# EAGLE design Computer Power Relay - Merge (EAGLE 9.6.2)
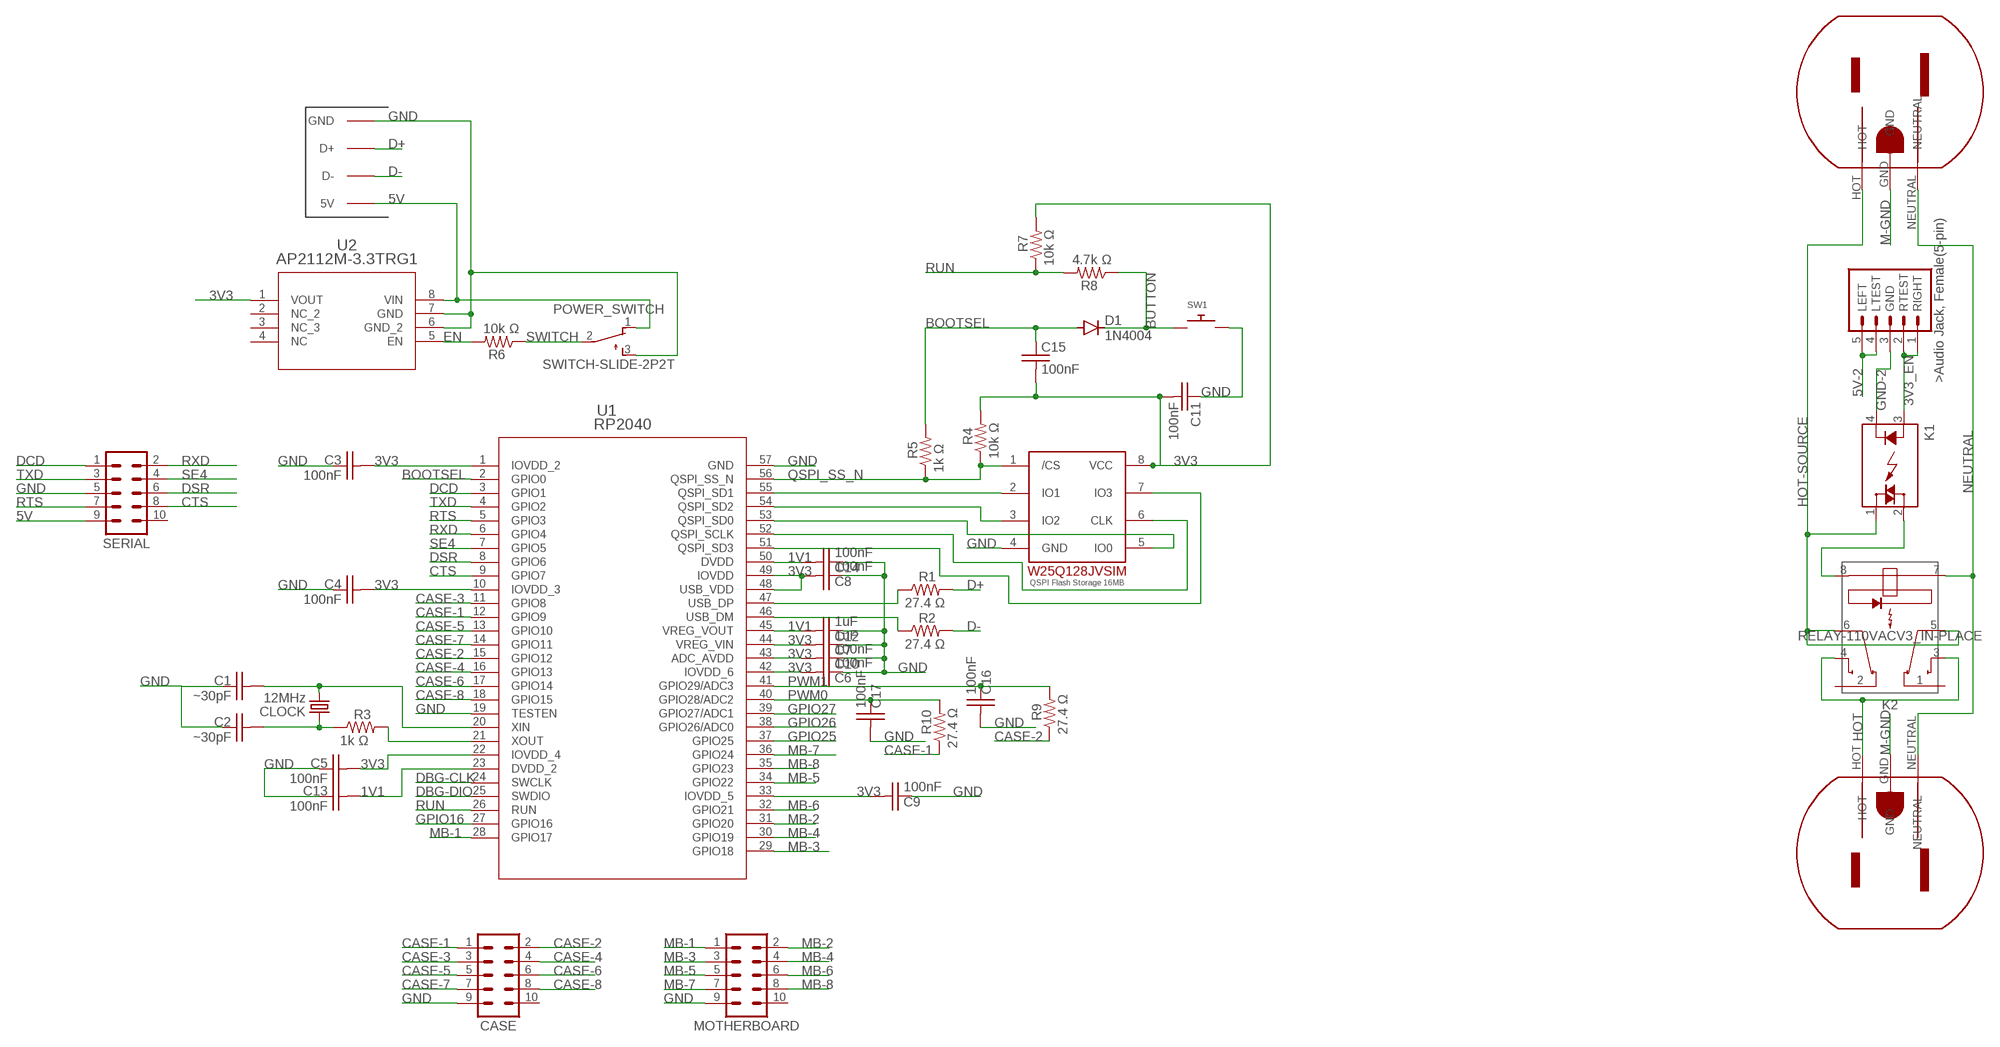
[diagram p0: schematic, sheet 1]

## Parts
C1  ~30pF  CAP-NONPOL-USC0402K  [C0402K]
C2  ~30pF  CAP-NONPOL-USC0402K  [C0402K]
C3  100nF  CAP-NONPOL-USC0402K  [C0402K]
C4  100nF  CAP-NONPOL-USC0402K  [C0402K]
C5  100nF  CAP-NONPOL-USC0402K  [C0402K]
C6  100nF  CAP-NONPOL-USC0402K  [C0402K]
C7  1uF  CAP-NONPOL-USC0402K  [C0402K]
C8  100nF  CAP-NONPOL-USC0402K  [C0402K]
C9  100nF  CAP-NONPOL-USC0402K  [C0402K]
C10  100nF  CAP-NONPOL-USC0402K  [C0402K]
C11  100nF  CAP-NONPOL-USC0402K  [C0402K]
C12  1uF  CAP-NONPOL-USC0402K  [C0402K]
C13  100nF  CAP-NONPOL-USC0402K  [C0402K]
C14  100nF  CAP-NONPOL-USC0402K  [C0402K]
C15  100nF  CAP-NONPOL-USC0402K  [C0402K]
C16  100nF  CAP-NONPOL-USC0402K  [C0402K]
C17  100nF  CAP-NONPOL-USC0402K  [C0402K]
CASE  MA05-2  [MA05-2]
CLOCK  12MHz  CRYSTALHC49S  [HC49/S]
D1  1N4004  [DO41-10]
K1  RELAY-3V3DC-110VAC012  [RELAY-3V3-110V]
K2  RELAY-110VACV3_IN-PLACE  [RELAY-110VAC-V3]
MOTHERBOARD  MA05-2  [MA05-2]
POWER_SWITCH  SWITCH-SLIDE-2P2T  [SWITCH-SLIDE-2P2T]
R1  27.4 Ω  R-US_R0603  [R0603]
R2  27.4 Ω  R-US_R0603  [R0603]
R3  1k Ω  R-US_R0603  [R0603]
R4  10k Ω  R-US_R0603  [R0603]
R5  1k Ω  R-US_R0603  [R0603]
R6  10k Ω  R-US_R0603  [R0603]
R7  10k Ω  R-US_R0603  [R0603]
R8  4.7k Ω  R-US_R0603  [R0603]
R9  27.4 Ω  R-US_R0603  [R0603]
R10  27.4 Ω  R-US_R0603  [R0603]
SERIAL  MA05-2  [MA05-2]
SW1  SWITCH_PUSHBUTTONSOFTTOUCHSMD_SJ  [PUSHBUTTON_TH]
U1  RP2040  [IC57_RP2040]
U2  AP2112M-3.3TRG1  [AP2112M-3.3TRG1_DIO]
U$1  W25Q128JVSIM-ND__QSPI-FLASH  [SO08]
U$2  PCB_USB  [PCB_USB]
U$3  MAINS-POWER-OUTLET3-PIN  [3-PIN-POWER]
U$4  MAINS-POWER-OUTLET3-PIN  [3-PIN-POWER]
U$5  AUDIO_JACK_FEMALE_5-PIN  [AUDIO_JACK_FEMALE_5-PIN]

## Nets
1V1: C12.2 C13.2 C14.2 U1.23(DVDD_2) U1.45(VREG_VOUT) U1.50(DVDD)
3V3: C3.2 C4.2 C5.2 C6.2 C7.2 C8.2 C9.2 C10.2 C11.2 C15.2 R4.2 R7.2 U1.1(IOVDD_2) U1.10(IOVDD_3) U1.22(IOVDD_4) U1.33(IOVDD_5) U1.42(IOVDD_6) U1.43(ADC_AVDD) U1.44(VREG_VIN) U1.48(USB_VDD) U1.49(IOVDD) U2.1(VOUT) U$1.8(VCC)
3V3_EN: K1.3 U$5.1(RIGHT) U$5.2(RTEST)
5V: POWER_SWITCH.1(O) SERIAL.9 U2.8(VIN) U$2.5V U$2.5V_2(5V)
5V-2: U$5.4(LTEST) U$5.5(LEFT)
BOOTSEL: C15.1 D1.A R5.2 U1.2(GPIO0)
BUTTON: D1.C R8.1 SW1.P$1
CASE-1: CASE.1 R10.1 U1.12(GPIO9)
CASE-2: CASE.2 R9.1 U1.15(GPIO12)
CASE-3: CASE.3 U1.11(GPIO8)
CASE-4: CASE.4 U1.16(GPIO13)
CASE-5: CASE.5 U1.13(GPIO10)
CASE-6: CASE.6 U1.17(GPIO14)
CASE-7: CASE.7 U1.14(GPIO11)
CASE-8: CASE.8 U1.18(GPIO15)
CTS: SERIAL.8 U1.9(GPIO7)
D+: R1.2 U$2.D+ U$2.D+_2(D+)
D-: R2.2 U$2.D- U$2.D-_2(D-)
DBG-CLK: U1.24(SWCLK)
DBG-DIO: U1.25(SWDIO)
DCD: SERIAL.1 U1.3(GPIO1)
DSR: SERIAL.6 U1.8(GPIO6)
EN: R6.2 U2.5(EN)
GND: C1.1 C2.1 C3.1 C4.1 C5.1 C6.1 C7.1 C8.1 C9.1 C10.1 C11.1 C12.1 C13.1 C14.1 C16.2 C17.2 CASE.9 MOTHERBOARD.9 POWER_SWITCH.3(S) SERIAL.5 SW1.P$2 U1.19(TESTEN) U1.57(GND) U2.6(GND_2) U2.7(GND) U$1.4(GND) U$2.GND U$2.GND_2(GND)
GND-2: K1.4 U$5.3(GND)
GPIO16: U1.27(GPIO16)
GPIO25: U1.37(GPIO25)
GPIO26: U1.38(GPIO26/ADC0)
GPIO27: U1.39(GPIO27/ADC1)
HOT: K2.3 K2.4 U$4.HOT
HOT-SOURCE: K1.1 K2.5 K2.6 U$3.HOT
M-GND: U$3.GND U$4.GND
MB-1: MOTHERBOARD.1 U1.28(GPIO17)
MB-2: MOTHERBOARD.2 U1.31(GPIO20)
MB-3: MOTHERBOARD.3 U1.29(GPIO18)
MB-4: MOTHERBOARD.4 U1.30(GPIO19)
MB-5: MOTHERBOARD.5 U1.34(GPIO22)
MB-6: MOTHERBOARD.6 U1.32(GPIO21)
MB-7: MOTHERBOARD.7 U1.36(GPIO24)
MB-8: MOTHERBOARD.8 U1.35(GPIO23)
N$1: R1.1 U1.47(USB_DP)
N$2: R2.1 U1.46(USB_DM)
N$3: C2.2 CLOCK.2 R3.1
N$4: R3.2 U1.21(XOUT)
N$5: C1.2 CLOCK.1 U1.20(XIN)
N$9: K1.2 K2.8
N$16: U1.54(QSPI_SD2) U$1.3(IO2)
N$17: U1.55(QSPI_SD1) U$1.2(IO1)
N$18: U1.53(QSPI_SD0) U$1.5(IO0)
N$19: U1.52(QSPI_SCLK) U$1.6(CLK)
N$20: U1.51(QSPI_SD3) U$1.7(IO3)
NEUTRAL: K2.7 U$3.NEUTRAL U$4.NEUTRAL
PWM0: C17.1 R10.2 U1.40(GPIO28/ADC2)
PWM1: C16.1 R9.2 U1.41(GPIO29/ADC3)
QSPI_SS_N: R4.1 R5.1 U1.56(QSPI_SS_N) U$1.1(/CS)
RTS: SERIAL.7 U1.5(GPIO3)
RUN: R7.1 R8.2 U1.26(RUN)
RXD: SERIAL.2 U1.6(GPIO4)
SE4: SERIAL.4 U1.7(GPIO5)
SWITCH: POWER_SWITCH.2(P) R6.1
TXD: SERIAL.3 U1.4(GPIO2)
Unconnected: CASE.10 K2.1 K2.2 MOTHERBOARD.10 SERIAL.10 U2.2(NC_2) U2.3(NC_3) U2.4(NC)

## Library data of the parts
C1-C17 = adafruit:CAP-NONPOL-US: CAPACITOR, American symbol
CASE MOTHERBOARD SERIAL = con-lstb:MA05-2: PIN HEADER; OC_FARNELL: unknown; OC_NEWARK: unknown
CLOCK = crystal:CRYSTAL: CRYSTAL; OC_FARNELL: 1667008; OC_NEWARK: unknown
D1 = KVM Keyboard:1N4004: DIODE general purpose rectifier, 1 A
K1 = Inventory:RELAY-3V3DC-110VAC: AUTOMOTIVE LOW PROFILE MICRO-280 RELAY NAiS Source: http://www.mew-europe.com/.. en_ds_61214_0000.pdf; MPN: ACV33012; OC_FARNELL: unknown; OC_NEWARK: 39M3505
K2 = Inventory:RELAY-110VAC: SOLID STATE RELAY NAiS Source: http://www.mew-europe.com/.. en_ds_61606_0000.pdf
POWER_SWITCH = Inventory:SWITCH-SLIDE-2P2T: TINY SWITCH ON - MOM Source: http://www2.produktinfo.conrad.com/datenblaetter/700000-724999/705152-da-01-de-Subminiaturschalter_TL_36YO.pdf
R1-R10 = rcl:R-US_: RESISTOR, American symbol; SPICEPREFIX: R
SW1 = KVM Keyboard:SWITCH_PUSHBUTTON: Buttons SOFTTOUCHSMD_SJ - Soft touch temporary push button (Super Junk Akihabara) Compatible with SKPMANE010 [Mouser: 688-SKPMAN] C&K_KSS = Digikey: KSS221GLFS
U1 = KVM Keyboard:RP2040; COPYRIGHT: Copyright (C) 2022 Ultra Librarian. All rights reserved.; DIGI-KEY_PART_NUMBER_1: 2648-SC0908(7)TR-ND; DIGI-KEY_PART_NUMBER_2: 2648-SC0908(7)CT-ND; DIGI-KEY_PART_NUMBER_3: 2648-SC0908(7)DKR-ND; MANUFACTURER_PART_NUMBER: SC0908(7); MFR_NAME: Raspberry Pi
U2 = KVM Keyboard:AP2112M-3.3TRG1; COPYRIGHT: Copyright (C) 2022 Ultra Librarian. All rights reserved.; DIGI-KEY_PART_NUMBER_1: AP2112M-3.3TRG1DITR-ND; DIGI-KEY_PART_NUMBER_2: AP2112M-3.3TRG1DICT-ND; DIGI-KEY_PART_NUMBER_3: AP2112M-3.3TRG1DIDKR-ND; MANUFACTURER_PART_NUMBER: AP2112M-3.3TRG1; MFR_NAME: Diodes Inc
U$1 = KVM Keyboard:W25Q128JVSIM-ND__QSPI-FLASH: National LM3622 li-ion charger http://www.ladyada.net/library/eagle
U$2 = KVM Keyboard:PCB_USB
U$3 U$4 = Inventory:MAINS-POWER-OUTLET
U$5 = Inventory:AUDIO_JACK_FEMALE_5-PIN

## Net classes
0 default: clearance 0.205 mm

## Board
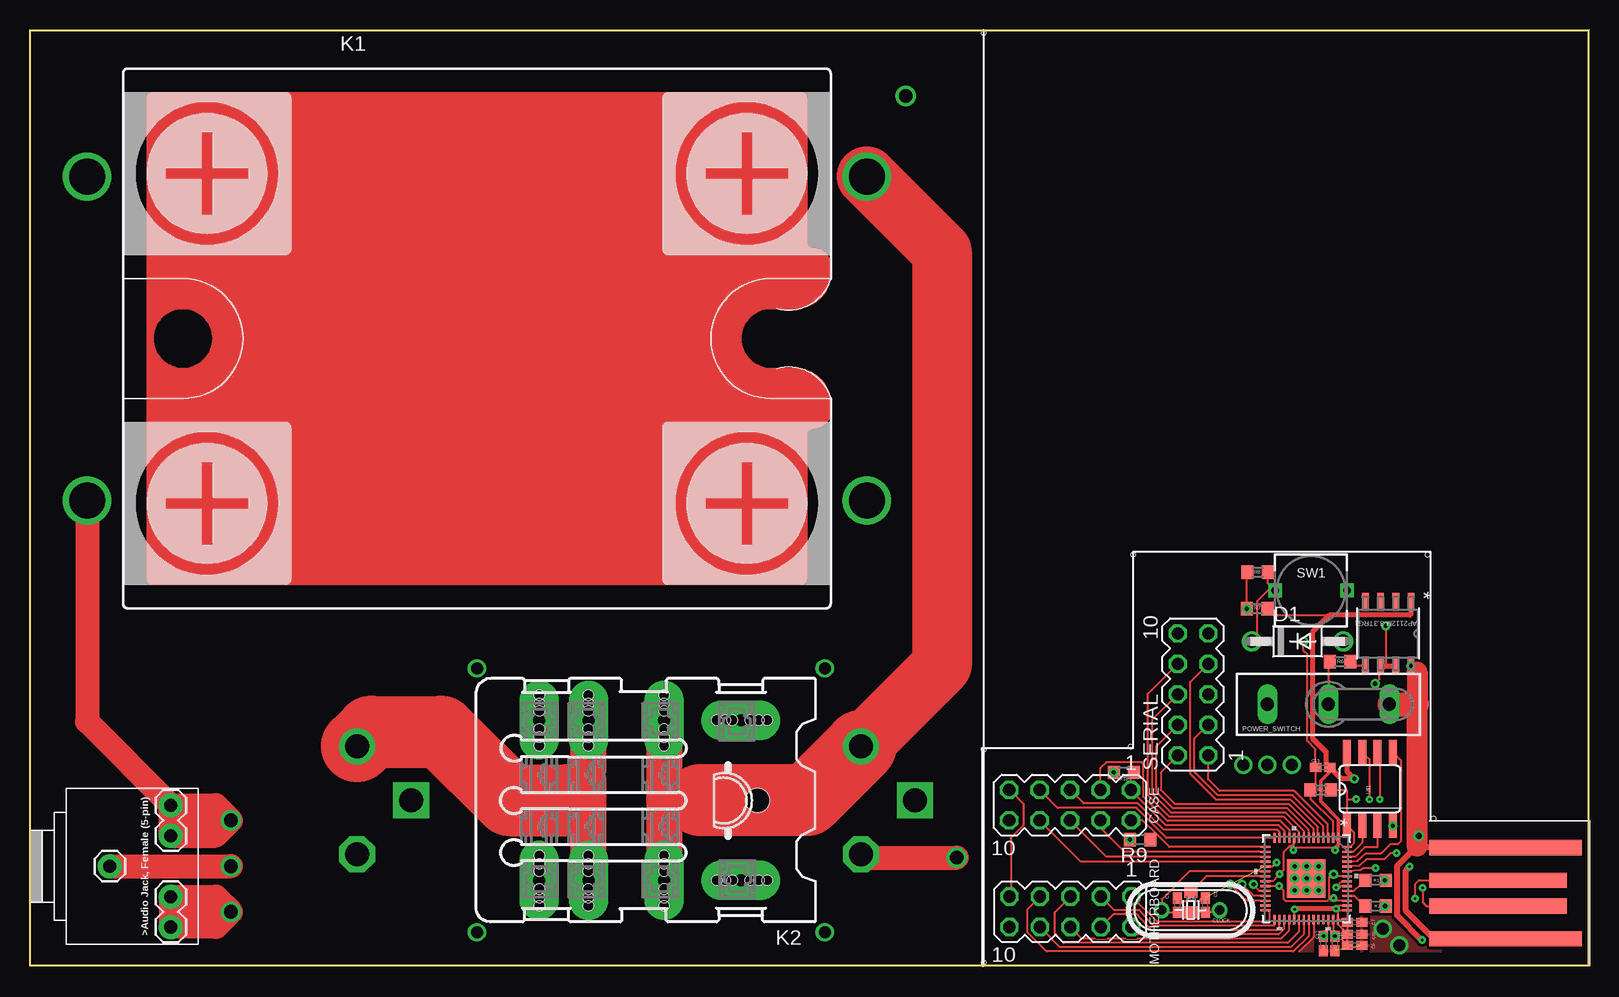
[diagram p1: board, top side]
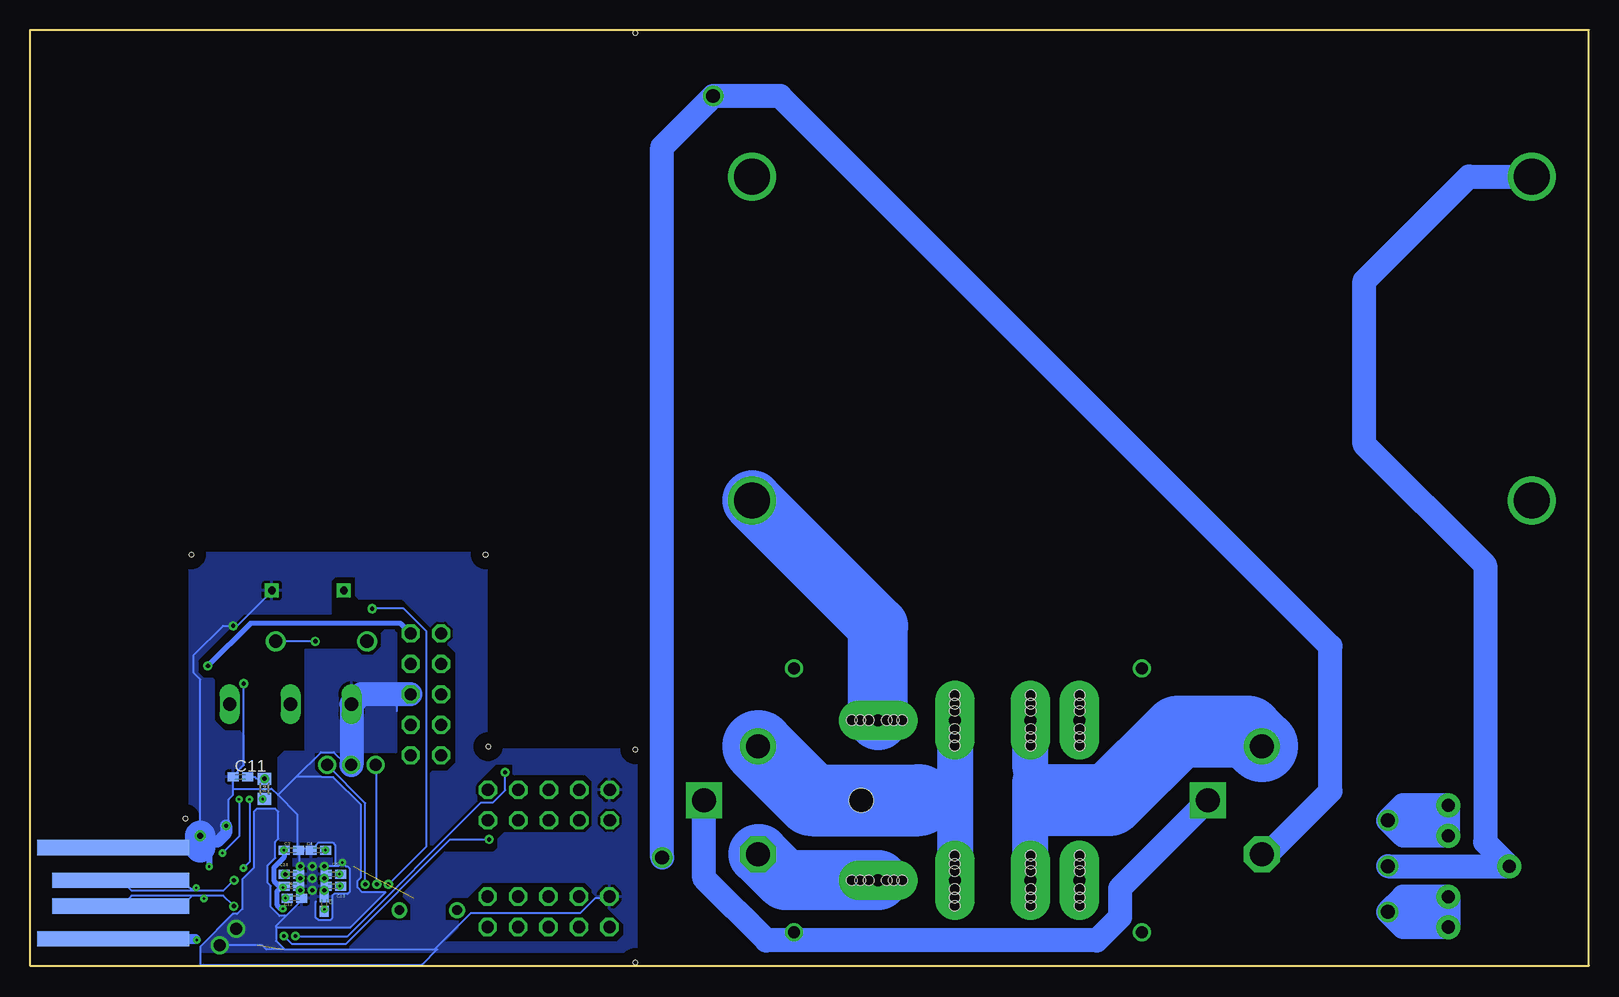
[diagram p2: board, bottom side, seen from below]

Size 129.95 x 78 mm. Coordinates in mm from the lower left corner, seen from the top.
Outline: 129.95,0 129.95,78 0,78 0,0 129.95,0
Copper layers (1*16): Top 0.035mm / dielectric 1.5mm / Bottom 0.035mm
Design rules "default": minimum track width 6mil, minimum drill 0.35mm, track to track 6mil, track to pad 6mil, pad to pad 6mil, via to via 6mil, smd to smd 6mil, copper to edge 40mil, drill to drill 6mil, minimum pad ring 10mil, minimum via ring 8mil, stop-mask expansion 4mil, vias tented up to drill 0mil, thermal gap 10mil
Holes 0.38 mm at 79.5,0.25 79.5,77.75 79.5,18 91.96,34.26 116.5,34.25 117,12.25 91.75,18.25

### Footprints (pad centres in the part's own frame; a part is rotated, then mirrored left to right if it is on the bottom)
C0402K = smd 0.925 x 0.74: 1 -0.6,0; 2 0.6,0
MA05-2 = drill 1.016 octagon: 1 -5.08,-1.27; 2 -5.08,1.27; 3 -2.54,-1.27; 4 -2.54,1.27; 5 0,-1.27; 6 0,1.27; 7 2.54,-1.27; 8 2.54,1.27; 9 5.08,-1.27; 10 5.08,1.27
HC49/S = drill 0.813: 1 -2.413,0; 2 2.413,0
DO41-10 = drill 1.118: A 3.81,0; C -3.81,0
RELAY-3V3-110V = drill 3: 1 -13.5,32.5; 2 13.5,32.5; 3 13.5,-32.5; 4 -13.5,-32.5
RELAY-110VAC-V3 = drill 1 pad 3.302 long: 1 -6.675,16.8; 2 6.675,16.8; 3 -6.675,12.7; 4 6.675,12.7; 5 -6.675,6.4; 6 6.675,6.4; 7 -6.675,0; 8 6.675,0 | drill 1: P$1 11,22; P$2 -11,22; P$3 -11,-7; P$4 11,-7 | hole 2: 0,-1.4 | hole 0.85: -7.4,16.8; -8.8,16.8; -8.1,16.8; -4.6,16.8; -5.3,16.8; -5.9,16.8; -7.4,12.7; -8.8,12.7; -8.1,12.7; -4.6,12.7; -5.3,12.7; -5.9,12.7; -7.4,6.4; -8.8,6.4; -8.1,6.4; -4.6,6.4; -5.3,6.4; -5.9,6.4; -6.675,-0.8; -6.675,-2.2; -6.675,-1.5; -6.675,2; -6.675,1.3; -6.675,0.7; 5.95,16.8; 4.55,16.8; 5.25,16.8; 8.75,16.8; 8.05,16.8; 7.45,16.8; 5.95,12.7; 4.55,12.7; 5.25,12.7; 8.75,12.7; 8.05,12.7; 7.45,12.7; 5.95,6.4; 4.55,6.4; 5.25,6.4; 8.75,6.4; 8.05,6.4; 7.45,6.4; 6.675,-0.8; 6.675,-2.2; 6.675,-1.5; 6.675,2; 6.675,1.3; 6.675,0.7
SWITCH-SLIDE-2P2T = drill 1.1 pad 1.422 long: 1 -5.08,0; 2 0,0; 3 5.08,0
R0603 = smd 1 x 1.1: 1 -0.85,0; 2 0.85,0
PUSHBUTTON_TH = drill 0.65 square: P$1 3,0; P$2 -3,0
IC57_RP2040 = smd 0.813 x 0.178: 1 -3.404,2.642; 2 -3.404,2.235; 3 -3.404,1.829; 4 -3.404,1.422; 5 -3.404,1.016; 6 -3.404,0.61; 7 -3.404,0.203; 8 -3.404,-0.203; 9 -3.404,-0.61; 10 -3.404,-1.016; 11 -3.404,-1.422; 12 -3.404,-1.829; 13 -3.404,-2.235; 14 -3.404,-2.642; 29 3.404,-2.642; 30 3.404,-2.235; 31 3.404,-1.829; 32 3.404,-1.422; 33 3.404,-1.016; 34 3.404,-0.61; 35 3.404,-0.203; 36 3.404,0.203; 37 3.404,0.61; 38 3.404,1.016; 39 3.404,1.422; 40 3.404,1.829; 41 3.404,2.235; 42 3.404,2.642 | smd 0.178 x 0.813: 15 -2.642,-3.404; 16 -2.235,-3.404; 17 -1.829,-3.404; 18 -1.422,-3.404; 19 -1.016,-3.404; 20 -0.61,-3.404; 21 -0.203,-3.404; 22 0.203,-3.404; 23 0.61,-3.404; 24 1.016,-3.404; 25 1.422,-3.404; 26 1.829,-3.404; 27 2.235,-3.404; 28 2.642,-3.404; 43 2.642,3.404; 44 2.235,3.404; 45 1.829,3.404; 46 1.422,3.404; 47 1.016,3.404; 48 0.61,3.404; 49 0.203,3.404; 50 -0.203,3.404; 51 -0.61,3.404; 52 -1.016,3.404; 53 -1.422,3.404; 54 -1.829,3.404; 55 -2.235,3.404; 56 -2.642,3.404 | smd 3.2 x 3.2: 57 0,0
AP2112M-3.3TRG1_DIO = smd 1.422 x 0.559: 1 -2.692,1.905; 2 -2.692,0.635; 3 -2.692,-0.635; 4 -2.692,-1.905; 5 2.692,-1.905; 6 2.692,-0.635; 7 2.692,0.635; 8 2.692,1.905
SO08 = smd 0.66 x 2.032: 1 -1.905,-3.073; 2 -0.635,-3.073; 3 0.635,-3.073; 4 1.905,-3.073; 5 1.905,3.073; 6 0.635,3.073; 7 -0.635,3.073; 8 -1.905,3.073
PCB_USB = smd 1.27 x 12.7: 5V -3.81,6.35; GND 3.81,6.35 | smd 1.27 x 12.7 bottom: 5V_2 3.81,6.35; GND_2 -3.81,6.35 | smd 1.27 x 11.43: D+ 1.079,5.715; D- -1.079,5.715 | smd 1.27 x 11.43 bottom: D+_2 -1.079,5.715; D-_2 1.079,5.715
3-PIN-POWER = drill 2 square: GND 0,4.5 | drill 2: HOT -4.5,0 | drill 2 octagon: NEUTRAL 4.5,0
AUDIO_JACK_FEMALE_5-PIN = drill 1.1 pad 2: 1 -5.08,2.73; 2 -2.54,2.73; 3 0,-2.35; 4 2.54,2.73; 5 5.08,2.73

### Placement (x,y rotation side)
C1  95.65,5.03 270 top
C2  97.97,5.03 270 top
C3  108.17,9.62 180 bottom
C4  105.92,9.62 0 bottom
C5  104.67,7.62 0 bottom
C6  110.42,1.68 180 top
C7  110.42,3.62 180 top
C8  108.17,6.62 180 bottom
C9  105.42,5.12 270 bottom
C10  110.42,2.62 180 top
C11  112.4,15.73 0 bottom
C12  107.92,5.62 180 bottom
C13  104.67,6.62 0 bottom
C14  108.17,7.62 180 bottom
C15  107.76,16.53 0 top
C16  108.77,1.84 270 top
C17  107.82,1.84 270 top
CASE  86.7,13.37 180 top
CLOCK  96.75,4.62 0 top
D1  105.66,27.03 0 top
K1  37.25,52.28 270 top
K2  59.25,13.78 90 top
MOTHERBOARD  86.73,4.48 180 top
POWER_SWITCH  108.23,21.79 180 top
R1  112.17,7.11 0 top
R2  112.17,4.95 0 top
R3  96.78,5.31 90 top
R4  110.4,14.73 90 bottom
R5  107.6,14.64 180 top
R6  109.22,25.33 0 top
R7  102.28,29.75 0 top
R8  102.33,32.79 180 top
R9  92.53,10.5 180 top
R10  91.18,16.11 180 top
SERIAL  96.95,22.61 90 top
SW1  106.79,31.27 180 top
U1  106.39,7.24 270 top
U2  113.22,27.68 270 top
U$1  111.69,14.73 0 top
U$2  116.67,6.03 270 top
U$3  69.25,13.78 270 top
U$4  27.25,13.78 270 top
U$5  9,8.28 270 top

### Tracks (layer width: path | path; a pad name or v marks a point on that pad's centre or on a via)
1V1  (via drill 0.2, 0.35)
  Top 0.152: U1.50 108.84,7.44 | 108.84,7.44 108.35,7.44 108.27,7.37 108.27,5.6 | 108.16,5.41 108.11,5.36 104.67,5.36 104.51,5.52 104.51,6.22 v104.11,6.62 104.05,6.63 U1.23 102.97,6.62 | 109.83,5.37 U1.45 108.46,5.41 v108.67,5.62 | v108.67,7.62 108.84,7.44
  Bottom 0.152: C14.2 v108.67,7.62 | C12.2 v108.67,5.62 | C13.2 104.09,6.7 v104.11,6.62
  pour Top: 108.27,5.6 108.46,5.41 108.16,5.41 108.27,5.52
3V3  (via drill 0.2, 0.35)
  Top 0.152: 109.11,6.43 109.31,6.63 U1.48 | 109.11,6.43 109.11,6.76 109.38,7.04 U1.49 109.45,7.04 | v108.86,6.51 109.03,6.35 109.11,6.43 | v108.88,4.73 109.15,5 U1.44 U1.43 | v108.88,4.73 109.01,4.6 U1.43 | v108.88,4.73 109.03,4.57 U1.42 | v104.17,7.62 104.51,7.96 104.51,9.46 104.92,9.87 | v104.17,7.62 104.12,7.57 | 104.12,7.57 103.59,7.04 U1.22 | 105,9.96 105.17,9.96 105.37,10.16 U1.10 105.37,9.67 v105.31,9.62 | 104.92,9.87 105,9.96 | 105,9.96 105.09,9.87 | 105.09,9.87 108.74,9.87 109.03,10.16 U1.1 109.08,10.69 109.08,10.68 109.12,10.64 | 105.09,9.87 104.92,9.87 | U1.43 109.81,4.58 C7.2 | C7.2 C10.2 | C10.2 109.81,2.67 | C10.2 C6.2 109.44,2.05 109.44,3.02 109.03,3.43 U1.42 | C7.2 109.59,3.83 U1.42 | U1.33 105.37,4.65 v105.42,4.69 105.45,4.73 | U$1.8 109.79,17.99 | R7.2 103.66,29.22 108.32,29.22 | 115.12,30.25 U2.1 | v104.17,7.62 104.09,7.6 104.12,7.57
  Top 0.241: 109.03,10.16 109.03,9.88
  Top 0.29: 109.12,10.64 109.12,10.2 109.06,10.14 | 109.03,9.88 v108.78,9.63 | 108.36,16.5 C15.2 108.36,16.15 107.6,15.38 107.6,13.68 109.08,12.19 109.08,10.69
  Top 0.406: v108.88,4.73 105.45,4.73 | U$1.8 109.79,16.19 R4.2 109.32,15.58 C15.2 108.03,16.86 108.03,17.83 106.95,18.92 106.95,27.85 108.32,29.22 115.03,29.22 115.12,29.31 U2.1
  Bottom 0.152: C3.2 v108.78,9.63 | C11.2 111.19,15.73 111.04,15.58 R4.2 110.5,15.68 | v105.42,4.69 105.34,4.56 C9.2 | C5.2 104.09,7.78 v104.17,7.62
  Bottom 0.406: C3.2 108.77,9.03 109.64,8.15 109.64,7.08 109.18,6.62 C8.2 v108.86,6.51 109.03,6.51 109.39,6.15 109.39,5.08 109.03,4.72 v108.88,4.72 v108.88,4.73
  other vias: 110.4,15.58
3V3_EN  (via drill 1.15)
  Top 2: U$5.1 15.5,13.36 15.5,13.35 v16.75,12.1 | U$5.2 U$5.1 | U$5.2 13.01,12.1 v16.75,12.1 | U$5.2 15.47,10.82 v16.75,12.1 | K1.3 4.75,20.34 U$5.1
  Bottom 2: v16.75,12.1 15.5,13.35 15.5,13.36 U$5.1 U$5.2 | U$5.2 15.47,10.82 v16.75,12.1 | U$5.2 13.01,12.1 v16.75,12.1
5V  (via drill 0.2, 0.35)
  Top 0.406: U2.8 115.63,24.47
  Top 0.508: U$2.5V 115.52,9.84 | 115.63,9.96 115.52,9.84 | 115.52,9.84 113.98,8.3 113.98,4.18 v116.04,2.12
  Top 1.75: 115.63,9.96 115.63,21.79 115.63,24.47
  Top 2: POWER_SWITCH.1 115.63,21.79
  Bottom 0.406: SERIAL.9 99.06,28.53 111.58,28.53 U2.8
  Bottom 0.508: v116.04,2.12 116.15,2.22
  Bottom 0.813: U$2.5V_2 116.15,2.22
  other vias: 115.12,24.99
5V-2  (via drill 1.15)
  Top 0.152: U$5.5 11.79,3.22 11.79,5.72 U$5.4
  Top 2: v16.75,4.47 15.5,3.22 11.79,3.22 | U$5.4 U$5.5 | U$5.4 13,4.47 v16.75,4.47 | U$5.4 15.48,5.74 v16.75,4.47
  Bottom 2: v16.75,4.47 15.48,3.2 U$5.5 U$5.4 | U$5.4 13,4.47 v16.75,4.47 | U$5.4 15.48,5.74 v16.75,4.47
BOOTSEL  (via drill 0.35)
  Top 0.152: U1.2 108.62,12 106.75,13.88 R5.2 107.16,15.06 C15.1 107.16,18.02 106.47,18.72 106.47,25.97 106.16,26.28 v106.16,27.04
  Bottom 0.152: v106.16,27.04 D1.A
BUTTON
  Top 0.152: R8.1 103.18,31.88 SW1.P$1 103.2,31.27 102.29,30.36 102.29,27.47 D1.C
CASE-1
  Top 0.152: U1.12 104.56,11.23 104.1,11.69 94.68,11.69 91.78,14.59 CASE.1 91.78,15.86 R10.1
CASE-2
  Top 0.152: U1.15 94.96,9.88 93.84,11 | CASE.2 92.74,12.1 93.84,11 | R9.1 93.84,10.96 93.84,11
CASE-3
  Top 0.152: U1.11 104.97,11.33 104.25,12.04 94.83,12.04 92.82,14.05 92.82,16.77 92.65,16.95 89.72,16.95 89.24,16.46 CASE.3
CASE-4
  Top 0.152: U1.16 91.24,9.47 89.24,11.47 CASE.4
CASE-5
  Top 0.152: U1.13 104.16,11.13 103.95,11.33 94.53,11.33 92.36,13.5 87.84,13.5 CASE.5
CASE-6
  Top 0.152: U1.17 89.73,9.07 CASE.6
CASE-7
  Top 0.152: U1.14 94.71,10.64 92.21,13.14 85.66,13.14 CASE.7
CASE-8
  Top 0.152: U1.18 87.6,8.66 CASE.8
CTS
  Top 0.152: U1.9 105.78,11.13 104.51,12.4 94.97,12.4 93.18,14.2 93.18,22.65 SERIAL.8
D+  (via drill 0.2, 0.35)
  Top 0.152: v116.09,6.48 116.09,5.27 116.41,4.95 U$2.D+ | v112.94,7.11 112.84,7.24 R1.2
  Bottom 0.152: v112.95,7.12 113.01,7.05 | 113.01,7.05 113.83,6.23 116.41,6.23 116.41,6.24 | U$2.D+_2 121.49,6.24 116.41,6.24 | 116.41,6.24 116.47,6.29 | 116.47,6.29 116.79,6.62 | v112.94,7.11 113.02,7.06 113.01,7.05 | 116.47,6.29 116.42,6.35 116.24,6.35 v116.09,6.48
D-  (via drill 0.2, 0.35)
  Top 0.152: v115.46,5.59 115.46,6.79 115.78,7.11 U$2.D- | v112.96,4.95 113.02,5.1 R2.2
  Bottom 0.152: v112.96,4.95 113.06,5.05 | 113.06,5.05 113.84,5.83 115.35,5.83 | U$2.D-_2 121.49,5.83 116.41,5.83 | 115.35,5.83 116.41,5.83 | 116.41,5.83 116.92,5.32 | v112.96,4.95 113.02,5.1 113.06,5.05 | 115.35,5.83 115.35,5.81 115.35,5.63 v115.46,5.59
DBG-CLK  (via drill 0.35, 1)
  Top 0.152: U1.24 102.48,6.22 102,6.7 v102,6.78
  Bottom 0.152: v102,6.78 102,13.53 v105.19,16.73
DBG-DIO  (via drill 0.35, 1)
  Top 0.152: U1.25 102,5.82 v101.03,6.78
  Bottom 0.152: v101.03,6.78 101.03,16.64 v101.13,16.73
DCD
  Top 0.152: U1.3 108.18,10.68 108.18,11.76 105.39,14.55 99.18,14.55 98.22,15.5 SERIAL.1
DSR
  Top 0.152: SERIAL.6 93.54,20.46 93.54,14.35 95.12,12.76 104.66,12.76 106.19,11.23 U1.8
EN
  Top 0.152: U2.5 110.41,24.98 R6.2
GND  (via drill 0.2, 0.35, 0.5, 1)  (2 unrouted)
  Top 0.152: U1.19 103.59,8.26 v103.92,8.58 | C2.1 97.69,5.63 97.44,5.38 96.11,5.38 95.86,5.62 C1.1 | U$2.GND 117.62,2.22 | MOTHERBOARD.9 81.75,5.81 81.75,10.63 82.82,11.71 82.82,13.49 81.75,14.57 CASE.9 | 103.19,16.89 v103.16,16.73 | v113.02,28.33 113.02,24.98 | v106.42,7.26 106.41,7.24 U1.57 106.41,7.06 106.41,6.35 v106.42,6.26 106.59,6.35 107.31,6.35 v107.42,6.26 | v106.42,8.27 106.41,8.13 106.41,7.42 v106.42,7.26 | v105.42,7.26 105.52,7.24 106.23,7.24 v106.42,7.26 | 108.69,1.32 108.73,1.34 C16.2 108.83,1.25 108.85,1.32 | v112.13,23.5 112.49,23.86 112.49,24.93 U2.6
  Top 0.406: U2.6 113.02,24.98 U2.7
  Top 0.508: v115.01,8.24 114.7,7.93 114.7,4.55 117.03,2.22
  Bottom 0.152: 105.31,8.37 v105.42,8.27 | SW1.P$2 109.81,31.19 112.67,28.33 v113.02,28.33 113.86,28.33 116.28,25.91 116.28,24.38 115.75,23.85 v115.75,10.81 | C3.1 107.48,9.74 106.59,9.74 C4.1 106.06,10.07 106.06,10.1 105.89,10.27 104.74,10.27 104.5,10.03 104.5,8.31 | C3.1 107.48,9.56 107.48,8.31 v107.42,8.27 107.48,8.13 107.48,7.78 C14.1 107.48,7.6 107.48,7.42 v107.42,7.26 107.48,7.24 107.48,6.7 C8.1 107.48,6.53 107.48,6.35 v107.42,6.26 107.31,6.17 107.31,5.63 C12.1 107.31,5.45 108.6,4.16 | v105.42,8.27 105.34,8.13 105.34,7.78 C5.1 105.34,7.6 105.34,7.42 v105.42,7.26 105.34,7.24 105.34,6.7 C13.1 105.34,6.53 105.34,6.35 v105.42,6.26 105.34,6.17 105.34,5.81 C9.1 | 104.5,8.31 105.34,8.31 v105.42,8.27 | 104.5,8.31 104.24,8.31 v103.92,8.58 103.6,8.27 103.49,8.27 103.32,8.1 103.32,6.13 103.49,5.96 104.6,5.96 104.75,5.82 104.75,3.95 104.93,3.77 105.9,3.77 106.12,4 106.12,5.32 | 113.02,14.74 113.02,14.21 113.38,13.85 | 113.02,14.74 113.02,15.64 C11.1 113.02,15.82 112.13,16.71 v112.13,23.5 | 113.38,13.85 113.38,12.06 U$1.4 | 109.27,14.21 109.81,14.74 113.02,14.74 | 109.27,14.21 107.66,12.6 107.66,9.74 C3.1 | 109.27,14.21 107.77,15.71 | 107.77,15.71 105.7,17.78 104.62,17.78 103.73,16.89 103.19,16.89 v103.16,16.73 | 96.23,1.34 93.19,4.38 84.07,4.38 82.82,5.63 81.75,5.63 MOTHERBOARD.9 | 96.23,1.34 96,1.34 97.28,0.07 115.75,0.07 115.75,1.58 113.03,4.29 112.68,4.29 112.25,4.73 112.25,7.2 111.3,8.16 111.3,12.81 111.05,13.06 109.5,13.06 109.25,12.81 109.25,10.56 109.51,10.31 109.51,8.97 110.12,8.36 110.12,6.88 109.87,6.62 109.87,4.88 109.14,4.14 108.64,4.14 108.62,4.16 108.6,4.16
  Bottom 0.152: 108.73,1.34 96.23,1.34 | 108.73,1.34 109.45,2.06 109.45,3.19 | 109.45,3.19 109.45,3.31 108.6,4.16 | 99.25,22.61 99.38,22.48 99.38,21.19 | 107.77,15.71 105.63,15.71 105.61,15.69 104.66,15.69 102.35,13.39 102.35,7.36 102.66,7.06 102.66,6.51 102.27,6.12 100.31,6.12 103.24,3.19 109.45,3.19 | 113.38,13.85 113.38,13.86 | 108.73,1.34 110.26,1.34 110.61,1.69 v114.12,1.69
  Bottom 0.508: v115.01,8.24 114.98,8.27 114.98,9.3 115.52,9.84 122.5,9.84 U$2.GND_2
  Bottom 1: 115.75,9.84 122.5,9.84 | v115.75,10.81 115.25,10.31 114.31,10.31 113.6,11.03 U$1.4
  Bottom 2: SERIAL.5 99.25,22.61 102.33,22.61 POWER_SWITCH.3 v103.15,16.73 v103.16,16.73
  Bottom 2.54: v115.75,10.81 115.75,9.84
  other vias: 113.6,11.65 112.75,3.06
  pour Top: 107.5,-0.06 117.62,-0.06 117.62,2.22 116.97,2.22 116.28,1.53 115.8,1.53 113.44,3.89 113.44,4.07 110.62,4.07 110.62,0.94 109,0.94 109,1.69 107.5,1.69
  pour Bottom: 107,26.32 107,17.82 99.38,17.82 99.38,27.69 99.62,27.94 100.38,27.94 100.62,27.69 100.62,26.57 101.38,25.82 102.25,25.82 102.75,26.32
  pour Bottom: 104.75,5.32 104.75,8.94 106.12,8.94 106.12,9.94 108,9.94 108,6.32 107.75,6.32 107.75,5.32
  pour Bottom: 106.12,5.32 107.38,5.32 109.38,3.31 109.38,3.19 103.25,3.19 100.38,6.07 102.25,6.07 102.75,6.57 102.75,7.07 102.38,7.44 102.38,13.31 104.75,15.69 105.62,15.69 106.25,16.32 106.25,17.82 108.75,17.82 109.25,17.32 109.25,10.56 109.12,10.44 108.12,10.44 108,10.31 108,9.94 106.38,9.94 106,10.31 104.75,10.31 104.5,10.06 104.5,8.31 103.5,8.31 103.25,8.06 103.25,6.19 103.5,5.94 104.62,5.94 104.75,5.82 104.75,3.94 105,3.69 105.88,3.69 106.25,4.07 106.25,5.19
  pour Bottom: 109.25,10.56 109.25,12.81 109.5,13.06 111,13.06 111.25,12.81 111.25,8.19 112.25,7.19 112.25,4.69 112.75,4.19 113,4.19 115.62,1.56 115.62,0.07 97.5,0.07 96.25,1.31 108.75,1.31 109.5,2.06 109.5,3.31 108.75,4.07 109.12,4.07 109.88,4.82 109.88,6.57 110.12,6.82 110.12,8.31 109.5,8.94 109.5,10.31
  pour Bottom: 96.12,1.31 94.25,3.19 94.25,3.69 101.12,3.69 103.25,1.56 103.25,1.31
  pour Bottom: 115.75,10.81 116.62,11.69 116.62,34.44 91.88,34.44 91.88,18.07 79.38,18.07 79.38,0.07 97.25,0.07 95.38,1.94 81,1.94 80.38,2.56 80.38,3.44 83,6.07 83,6.32 83.62,6.94 92.25,6.94 93.5,5.69 94.75,5.69 95.38,5.07 95.38,3.81 98.12,3.81 98.12,5.07 98.75,5.69 98.75,6.07 95.38,9.44 91.25,9.44 90.88,9.81 90.88,10.56 90.38,11.06 83.62,11.06 83,11.69 83,15.31 83.62,15.94 89.62,15.94 89.62,16.69 89.75,16.82 91.12,16.82 92.75,15.19 92.75,13.69 96.38,10.06 96.5,10.06 96.5,16.07 96.38,16.19 95.12,16.19 94.38,16.94 94.38,26.07 98.87,30.57 102.5,30.57 102.75,30.81 102.75,32.44 104.5,32.44 104.88,32.06 104.88,29.32 112.12,29.32 116,25.44 116,24.44 115.5,23.94 114.75,23.94 114.63,23.82 114.63,20.44 113.75,19.57 112.5,19.57 112.12,19.19 112.12,16.69 113.12,15.69 113.12,14.31 113.5,13.94 113.5,11.06 113.75,10.81
GND-2  (via drill 1.15)
  Top 2: U$5.3 v16.75,8.28
  Bottom 0.152: 6.69,8.28 U$5.3
  Bottom 2: v16.75,8.28 6.69,8.28 | U$5.3 8.65,10.28 8.65,33.39 18.71,43.45 18.71,57.07 10,65.78 K1.4
GPIO25
  Top 0.152: U1.37 107,2.36 105.81,1.17
  pour Top: 105.81,1.19 105.81,0.01 107,0.01 107,2.38
HOT
  Top 0.152: 46.55,16.8 46.64,16.8 46.55,15.51
  Top 1: 44.8,13.78 46.55,15.51
  Top 3: K2.3 46.55,15.51 | 46.55,16.39 46.55,16.8 K2.4
  Top 6: U$4.HOT 28.47,19.5 34.25,19.5 40,13.78 44.8,13.78
  Bottom 1: 44.8,13.78 46.55,15.51
  Bottom 3: K2.3 46.55,15.51 | 46.55,16.39 K2.4
  Bottom 6: U$4.HOT 28.47,19.5 34.25,19.5 40,13.78 44.8,13.78
HOT-SOURCE
  Top 1: 52.85,12.75 54.81,12.75 55.86,13.78
  Top 3: K2.6 52.85,12.75 K2.5
  Top 5: K1.1 76,59.53 76,25.03 U$3.HOT
  Top 6: U$3.HOT 64.77,13.78 55.86,13.78
  Bottom 1: 52.85,12.75 54.81,12.75 55.86,13.78
  Bottom 3: K2.6 52.85,12.75 K2.5
  Bottom 6: U$3.HOT 64.77,13.78 55.86,13.78
M-GND
  Bottom 2: U$4.GND 39.09,6.44 39.09,4.02 41.02,2.09 68.56,2.09 73.75,7.28 U$3.GND
MB-1
  Top 0.152: MOTHERBOARD.1 91.86,5.75 93.93,3.67 103.2,3.67 103.31,3.78 103.31,4.48 103.19,4.6 U1.28
MB-2
  Top 0.152: MOTHERBOARD.2 92.34,2.6 104.09,2.6 104.56,3.07 U1.31
MB-3
  Top 0.152: MOTHERBOARD.3 90.41,4.61 92.48,4.61 93.67,3.31 103.63,3.31 103.75,3.43 U1.29
MB-4
  Top 0.152: MOTHERBOARD.4 90.31,4.25 92.28,4.25 93.48,2.96 103.91,2.96 104.16,3.2 U1.30
MB-5
  Top 0.152: MOTHERBOARD.5 85.42,4.44 85.42,2.67 86.16,1.88 104.84,1.88 105.78,2.82 U1.34
MB-6
  Top 0.076: 88.75,2.24 88.88,2.21 | 89.69,2.21 89.81,2.24
  Top 0.079: 88.88,2.21 89.69,2.21 | 91.3,2.24 91.38,2.21 92.25,2.21 92.32,2.24
  Top 0.152: 92.32,2.24 104.26,2.24 104.97,2.95 U1.32 | 91.3,2.24 89.81,2.24 | 88.75,2.24 87.7,2.24 MOTHERBOARD.6
MB-7
  Top 0.152: MOTHERBOARD.7 83.15,4.71 83.15,2.77 84.74,1.17 105.31,1.17 106.59,2.46 U1.36
MB-8
  Top 0.152: MOTHERBOARD.8 85.85,1.53 105.12,1.53 106.19,2.59 U1.35
N$1
  Top 0.152: U1.47 110.37,6.22 R1.1
N$2
  Top 0.152: U1.46 110.39,5.82 R2.1
N$3
  Top 0.152: CLOCK.2 98.97,4.43 C2.2 96.8,4.43 R3.1
N$4
  Top 0.152: 102.5,7.44 U1.21 98.06,7.44 R3.2
N$5
  Top 0.152: CLOCK.1 94.34,5.54 96.64,7.85 U1.20 | CLOCK.1 | CLOCK.1 94.53,4.42 C1.2
N$9
  Bottom 5: K2.8 59.25,28.28 K1.2
N$16
  Top 0.152: U$1.3 112.33,9.87 111.27,9.87 110.47,9.07 U1.54
N$17
  Top 0.152: U$1.2 111.06,10.24 110.29,9.47 U1.55
N$18
  Top 0.152: U$1.5 114.29,17.11 114.29,10.37 114.04,10.12 113.42,10.12 112.67,9.37 111.37,9.37 110.67,8.71 U1.53
N$19  (via drill 0.2)
  Top 0.152: U$1.6 112.52,17.61 v112.52,13.85 | v113.92,9.37 113.42,9.37 112.92,8.87 111.42,8.87 110.81,8.31 U1.52
  Bottom 0.152: v112.52,13.85 112.52,10.76 v113.92,9.37
N$20  (via drill 0.2)
  Top 0.152: U$1.7 111.65,17.2 v111.65,13.85 | U1.51 110.9,7.95 111.17,8.12 v112.17,8.12
  Bottom 0.152: v112.17,8.12 111.65,8.63 v111.65,13.85
NEUTRAL  (via drill 1.15)
  Top 2: U$3.NEUTRAL 69.53,9 v77.25,9
  Bottom 2: v77.25,9 77.25,68.25 v73,72.5 67.43,72.5 21.55,26.62 21.55,14.54 26.8,9.28 U$4.NEUTRAL
  Bottom 5: K2.7 67,7.11 69.17,9.28 U$3.NEUTRAL
PWM0  (via drill 0.3, 0.35)
  Top 0.152: U1.40 108.22,3.12 107.82,2.72 v107.82,2.46 107.84,2.42 C17.1
  Bottom 0.152: v107.82,2.46 103.47,2.46 92.33,13.6 91.35,13.6 90.33,14.61 R10.2
  other vias: 90.33,16.11
PWM1  (via drill 0.3, 0.35)
  Top 0.152: U1.41 108.62,2.59 v108.77,2.45 108.73,2.42 C16.1
  Bottom 0.152: v108.77,2.45 108.15,1.82 103.59,1.82 94.92,10.5 R9.2
  other vias: 91.68,10.5
QSPI_SS_N  (via drill 0.2)
  Top 0.152: 109.79,13.85 109.79,14.64 R5.1 | 109.79,13.85 U$1.1 110.34,11.1 110.34,10.17 110.04,9.88 U1.56 | 109.79,13.85 110.52,13.85 v110.55,13.88
  Bottom 0.152: R4.1 v110.55,13.88
RTS
  Top 0.152: U1.5 107.37,10.68 107.37,11.56 105.1,13.83 98.88,13.83 96.73,15.99 96.73,23.65 SERIAL.7
RUN  (via drill 0.35)
  Top 0.152: R7.1 101.43,32.74 R8.2 | U1.26 101.45,5.41 v100.07,6.78
  Bottom 0.152: v100.07,6.78 96.9,9.96 96.9,27.84 98.81,29.75 R7.1
  other vias: 101.43,29.75
RXD
  Top 0.152: SERIAL.2 94.26,16.1 94.26,14.64 95.42,13.47 104.95,13.47 107,11.43 U1.6
SE4
  Top 0.152: U1.7 106.59,11.33 104.8,13.12 95.27,13.12 93.9,14.49 93.9,18.29 SERIAL.4
SWITCH
  Top 0.152: R6.1 108.23,25.19 POWER_SWITCH.2
TXD
  Top 0.152: U1.4 107.81,11.62 105.25,14.19 99.03,14.19 97.08,16.14 97.08,18.93 SERIAL.3

### Text on the board
tValues: Neutral | Hot | + - / HDD LED | - + / RESET SWITCH | PWR SWITCH / + - | PWR LED / + - | - + / RESET SWITCH | + - / HDD LED | PWR SWITCH / + - | PWR LED / + -